# Altium schematic sheet Sheet1.SchDoc
size A1
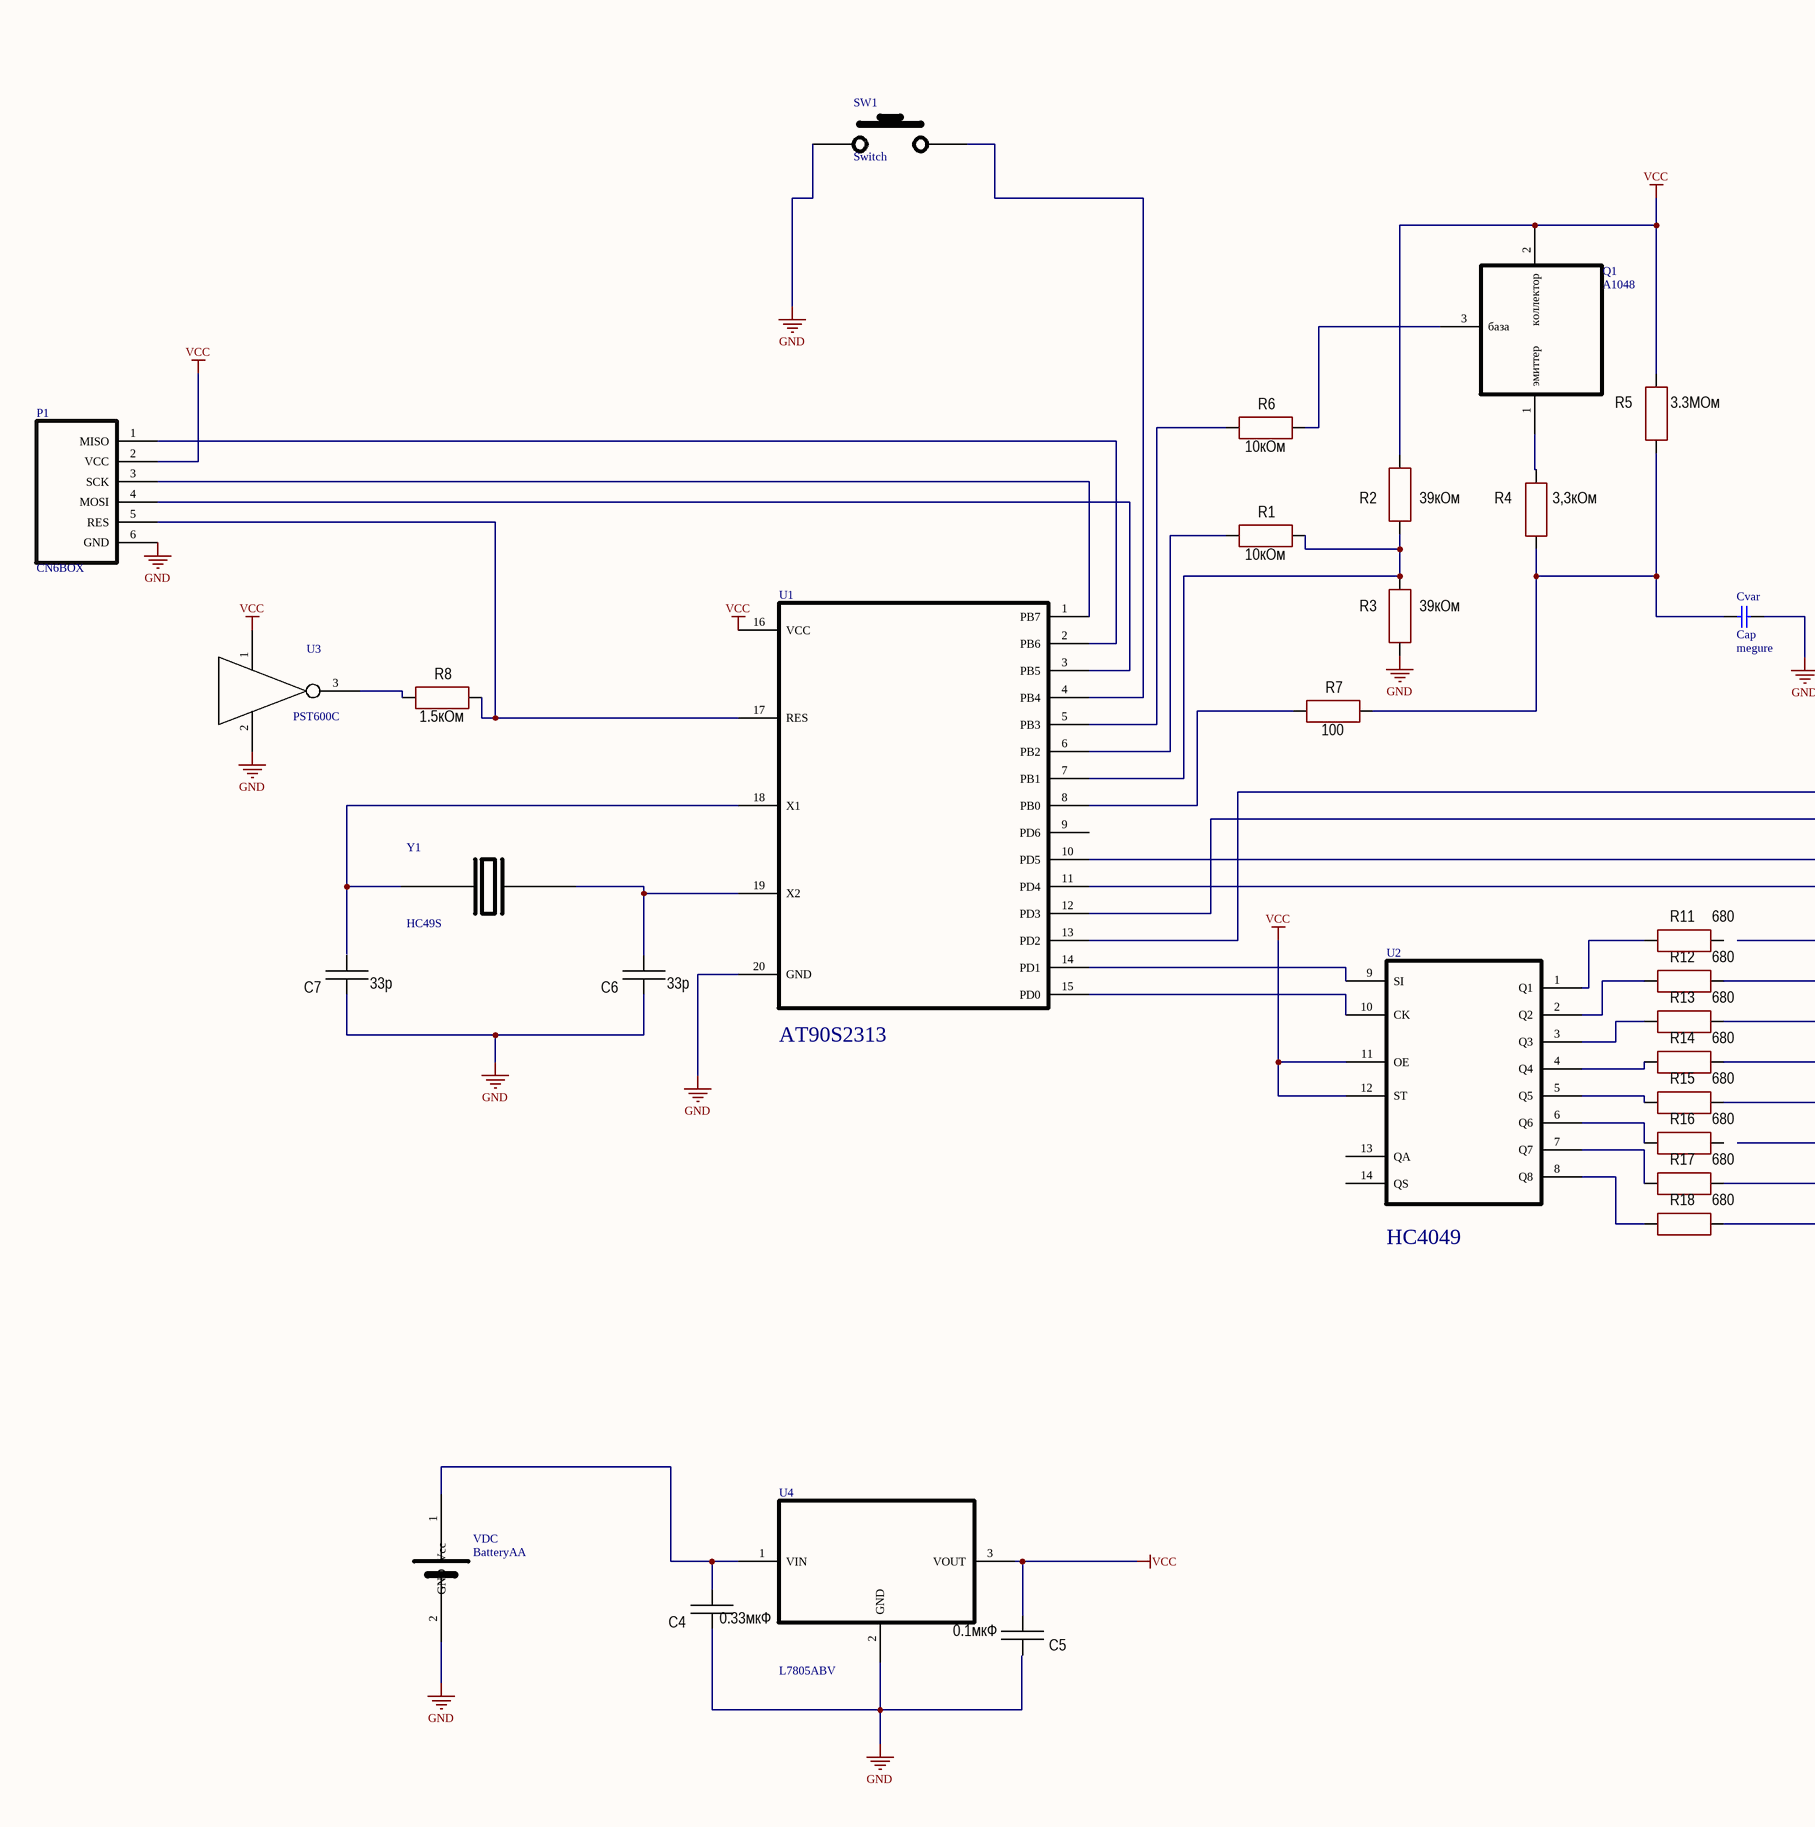
[diagram p0: Sheet1.SchDoc, left]
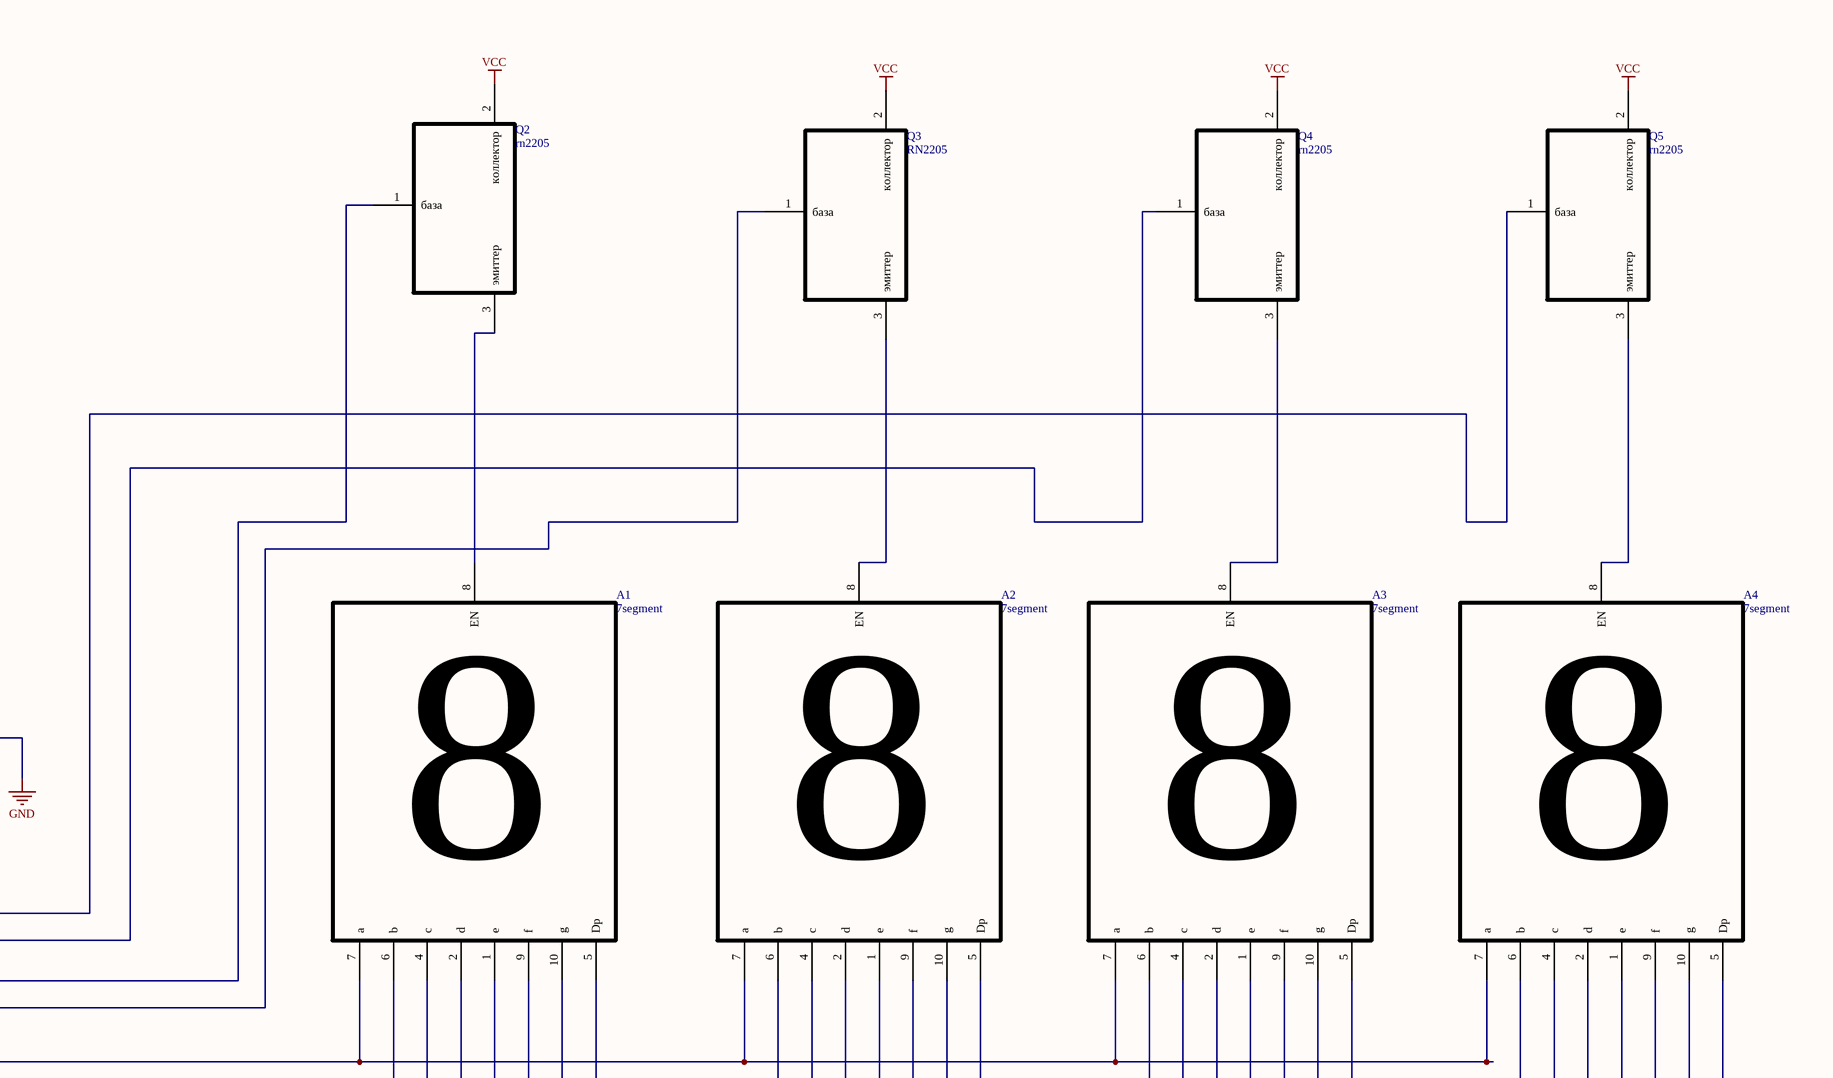
[diagram p1: Sheet1.SchDoc, right]

## Parts
A1  7segment  [7segment]
A2  7segment  [7segment]
A3  7segment  [7segment]
A4  7segment  [7segment]
C4  0.33мкФ  [CH1206C]
C5  0.1мкФ  [CH0402C]
C6  33p  [CH0805C]
C7  33p  [CH0805C]
Cvar  Cap  value megure  [RAD-0.3]
P1  CN6BOX  [CN6BOX]
Q1  A1048  [PST600C]
Q2  rn2205  [PST600C]
Q3  RN2205  [PST600C]
Q4  rn2205  [PST600C]
Q5  rn2205  [PST600C]
R1  10кОм  [CH0402R]
R2  39кОм  [CH0402R]
R3  39кОм  [CH0402R]
R4  3,3кОм  [CH0402R]
R5  3.3МОм  [CH0402R]
R6  10кОм  [CH0402R]
R7  100  [CH0402R]
R8  1.5кОм  [CH0402R]
R11  680  [CH1206R]
R12  680  [CH1206R]
R13  680  [CH1206R]
R14  680  [CH1206R]
R15  680  [CH1206R]
R16  680  [CH1206R]
R17  680  [CH1206R]
R18  680  [CH1206R]
SW1  Switch  [SWITCH]
U1  AT90S2313  [AT90S2313]
U2  HC4049  [HC4049]
U3  PST600C  [PST600C]
U4  L7805ABV  [7805]
VDC  BatteryAA  [Battery]
Y1  HC49S  [HC49S]

## Nets
GND: C4.1 C6.1 C7.1 Cvar.2 P1.6(GND) R3.1 SW1.1 U1.20(GND) U3.2(QS) U4.2(GND) VDC.2(GND)
VCC: C5.1 P1.2(VCC) Q1.2(коллектор) Q2.2(коллектор) Q3.2(коллектор) Q4.2(коллектор) Q5.2(коллектор) R2.2 R5.2 U1.16(VCC) U2.11(OE) U2.12(ST) U3.1(QS) U4.3(VOUT)
NetA1_1: A1.1(e) A2.1(e) A3.1(e) A4.1(e) R15.2
NetA1_2: A1.2(d) A2.2(d) A3.2(d) A4.2(d) R14.2
NetA1_4: A1.4(c) A2.4(c) A3.4(c) A4.4(c) R13.2
NetA1_5: A1.5(Dp) A2.5(Dp) A3.5(Dp) A4.5(Dp) R18.2
NetA1_6: A1.6(b) A2.6(b) A3.6(b) A4.6(b) R12.2
NetA1_7: A1.7(a) A2.7(a) A3.7(a) A4.7(a)
NetA1_8: A1.8(EN) Q2.3(эмиттер)
NetA1_9: A1.9(f) A2.9(f) A3.9(f) A4.9(f)
NetA1_10: A1.10(g) A2.10(g) A3.10(g) A4.10(g) R17.2
NetA2_8: A2.8(EN) Q3.3(эмиттер)
NetA3_8: A3.8(EN) Q4.3(эмиттер)
NetA4_8: A4.8(EN) Q5.3(эмиттер)
NetC4_2: C4.2 U4.1(VIN) VDC.1(Vcc)
NetC6_2: C6.2 U1.19(X2) Y1.2(QS)
NetCvar_1: Cvar.1 R4.1 R5.1 R7.2
NetP1_1: P1.1(MISO) U1.2(PB6)
NetP1_3: P1.3(SCK) U1.1(PB7)
NetP1_4: P1.4(MOSI) U1.3(PB5)
NetP1_5: P1.5(RES) R8.2 U1.17(RES)
NetQ1_1: Q1.1(эмиттер) R4.2
NetQ1_3: Q1.3(база) R6.2
NetQ2_1: Q2.1(база) U1.10(PD5)
NetQ3_1: Q3.1(база) U1.11(PD4)
NetQ4_1: Q4.1(база) U1.12(PD3)
NetQ5_1: Q5.1(база) U1.13(PD2)
NetR1_1: R1.1 U1.6(PB2)
NetR1_2: R1.2 R2.1 R3.2 U1.7(PB1)
NetR6_1: R6.1 U1.5(PB3)
NetR7_1: R7.1 U1.8(PB0)
NetR8_1: R8.1 U3.3(QS)
NetR11_1: R11.1 U2.1(Q1)
NetR12_1: R12.1 U2.2(Q2)
NetR13_1: R13.1 U2.3(Q3)
NetR14_1: R14.1 U2.4(Q4)
NetR15_1: R15.1 U2.5(Q5)
NetR16_1: R16.1 U2.6(Q6)
NetR17_1: R17.1 U2.7(Q7)
NetR18_1: R18.1 U2.8(Q8)
NetSW1_2: SW1.2 U1.4(PB4)
NetU1_14: U1.14(PD1) U2.9(SI)
NetU1_15: U1.15(PD0) U2.10(CK)
NetU1_18: U1.18(X1) Y1.1(QS)

Not connected (* = marked no-connect by the designer): C5 2; C7 2; R11 2; R16 2; U1 9(PD6); U2 13(QA) 14(QS)

## Notes on the sheet
- Title
- Size:
- Date:
- File:
- A1
- Number:
- Time:
- Revision:
- Sheet
- of

## Library data of the parts
C4-C7 = Capacitor: Manufacturer: *; Model: *; HelpURL: *; ComponentKind: *; Value: *
Cvar = Cap: Capacitor; Published: 8-Jun-2000; LatestRevisionDate: 17-Jul-2002; LatestRevisionNote: Re-released for DXP Platform.; PackageReference: RAD-0.3; Publisher: Altium Limited; PackageDescription: Radial Cap, Thru-Hole; 2 Leads; 0.3 in Pin Spacing
R1-R8 R11-R18 = Resistor: Manufacturer: *; Model: *; HelpURL: *; ComponentKind: *; Value: *
U4 = 7805